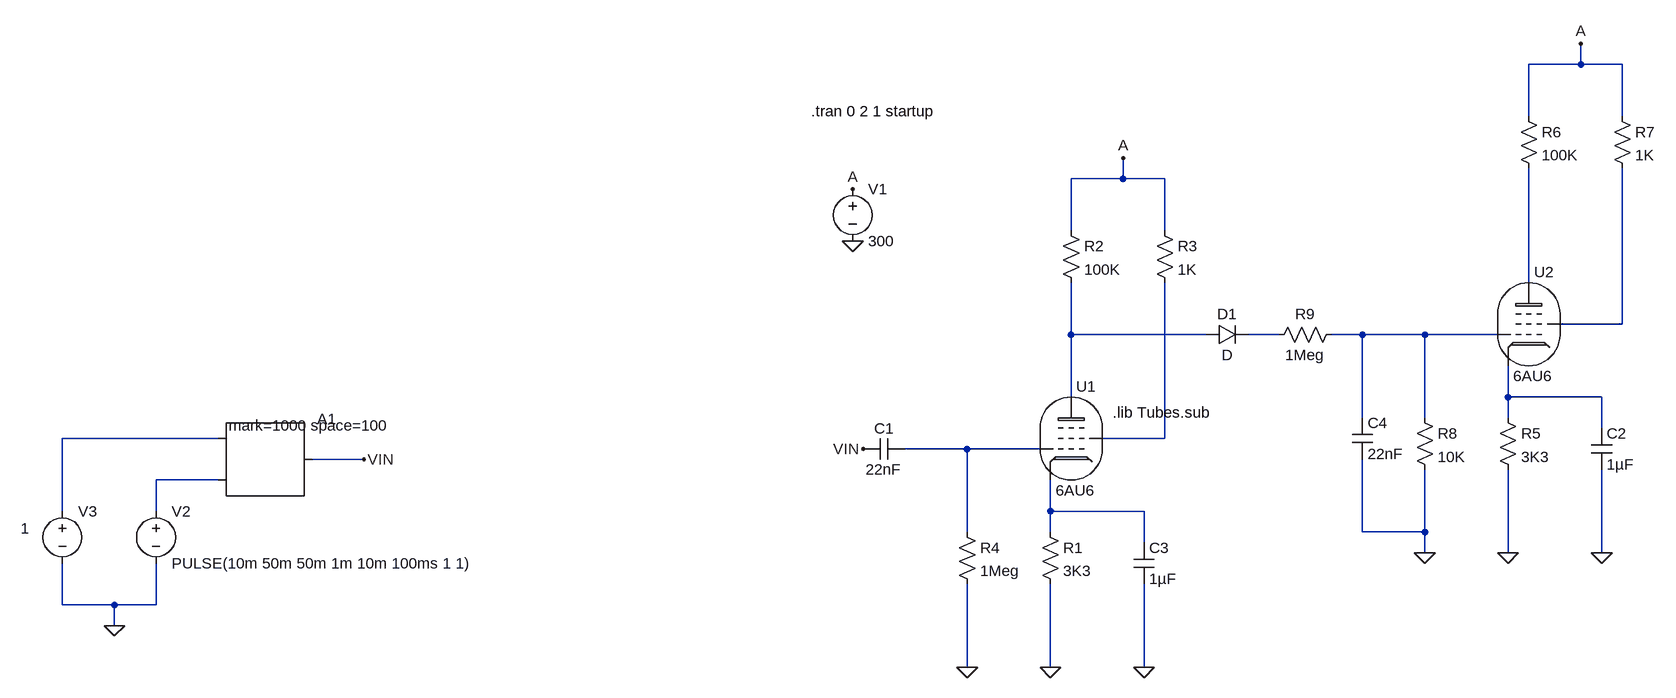
[diagram p0: schematic CompressorWith6AU6Penthode.asc]
CompressorWith6AU6Penthode.asc, the LTspice schematic file:
Version 4
SHEET 1 2100 680
WIRE 1232 -400 1232 -432
WIRE 1232 -400 1152 -400
WIRE 1296 -400 1232 -400
WIRE 1152 -320 1152 -400
WIRE 1296 -320 1296 -400
WIRE 528 -224 528 -256
WIRE 528 -224 448 -224
WIRE 592 -224 528 -224
WIRE 448 -144 448 -224
WIRE 592 -144 592 -224
WIRE 1152 -64 1152 -240
WIRE 1296 0 1296 -240
WIRE 1296 0 1200 0
WIRE 448 16 448 -64
WIRE 656 16 448 16
WIRE 768 16 720 16
WIRE 896 16 848 16
WIRE 992 16 896 16
WIRE 1104 16 992 16
WIRE 448 112 448 16
WIRE 1120 112 1120 64
WIRE 1264 112 1120 112
WIRE 896 144 896 16
WIRE 992 144 992 16
WIRE 1120 144 1120 112
WIRE 1264 160 1264 112
WIRE -864 176 -1104 176
WIRE 592 176 592 -64
WIRE 592 176 496 176
WIRE 288 192 192 192
WIRE 400 192 288 192
WIRE -640 208 -720 208
WIRE -864 240 -960 240
WIRE -1104 288 -1104 176
WIRE -960 288 -960 240
WIRE 416 288 416 240
WIRE 560 288 416 288
WIRE 288 320 288 192
WIRE 416 320 416 288
WIRE 896 320 896 208
WIRE 992 320 992 224
WIRE 992 320 896 320
WIRE 560 336 560 288
WIRE 992 352 992 320
WIRE 1120 352 1120 224
WIRE 1264 352 1264 224
WIRE -1104 432 -1104 368
WIRE -1024 432 -1104 432
WIRE -960 432 -960 368
WIRE -960 432 -1024 432
WIRE -1024 464 -1024 432
WIRE 288 528 288 400
WIRE 416 528 416 400
WIRE 560 528 560 400
FLAG 416 528 0
FLAG 528 -256 A
FLAG 288 528 0
FLAG 128 192 VIN
FLAG 112 -128 0
FLAG 112 -208 A
FLAG -1024 464 0
FLAG -640 208 VIN
FLAG 560 528 0
FLAG 1120 352 0
FLAG 1232 -432 A
FLAG 992 352 0
FLAG 1264 352 0
SYMBOL Misc\\pentode 448 176 R0
SYMATTR InstName U1
SYMATTR Value 6AU6
SYMBOL res 400 304 R0
SYMATTR InstName R1
SYMATTR Value 3K3
SYMBOL res 432 -160 R0
SYMATTR InstName R2
SYMATTR Value 100K
SYMBOL res 576 -160 R0
SYMATTR InstName R3
SYMATTR Value 1K
SYMBOL res 272 304 R0
SYMATTR InstName R4
SYMATTR Value 1Meg
SYMBOL voltage 112 -224 R0
WINDOW 123 0 0 Left 0
WINDOW 39 0 0 Left 0
SYMATTR InstName V1
SYMATTR Value 300
SYMBOL voltage -960 272 R0
WINDOW 123 0 0 Left 0
WINDOW 39 0 0 Left 0
SYMATTR InstName V2
SYMATTR Value PULSE(10m 50m 50m 1m 10m 100ms 1 1)
SYMBOL voltage -1104 272 R0
WINDOW 3 -64 42 Left 2
WINDOW 123 0 0 Left 0
WINDOW 39 0 0 Left 0
SYMATTR InstName V3
SYMATTR Value 1
SYMBOL SpecialFunctions\\modulate -864 176 R0
WINDOW 3 16 -20 Left 2
SYMATTR InstName A1
SYMATTR Value mark=1000 space=100
SYMBOL cap 544 336 R0
SYMATTR InstName C3
SYMATTR Value 1µF
SYMBOL cap 192 176 R90
WINDOW 0 0 32 VBottom 2
WINDOW 3 32 32 VTop 2
SYMATTR InstName C1
SYMATTR Value 22nF
SYMBOL Misc\\pentode 1152 0 R0
SYMATTR InstName U2
SYMATTR Value 6AU6
SYMBOL res 1104 128 R0
SYMATTR InstName R5
SYMATTR Value 3K3
SYMBOL res 1136 -336 R0
SYMATTR InstName R6
SYMATTR Value 100K
SYMBOL res 1280 -336 R0
SYMATTR InstName R7
SYMATTR Value 1K
SYMBOL res 976 128 R0
SYMATTR InstName R8
SYMATTR Value 10K
SYMBOL cap 1248 160 R0
SYMATTR InstName C2
SYMATTR Value 1µF
SYMBOL diode 656 32 R270
WINDOW 0 32 32 VTop 2
WINDOW 3 0 32 VBottom 2
SYMATTR InstName D1
SYMBOL cap 880 144 R0
SYMATTR InstName C4
SYMATTR Value 22nF
SYMBOL res 864 0 R90
WINDOW 0 0 56 VBottom 2
WINDOW 3 32 56 VTop 2
SYMATTR InstName R9
SYMATTR Value 1Meg
TEXT 512 136 Left 2 !.lib Tubes.sub
TEXT 48 -328 Left 2 !.tran 0 2 1 startup

The netlist it stands for:
* CompressorWith6AU6Penthode.asc
XU1 N003 N008 N009 N011 6AU6  ; pins Anode G2 G1 Cathode
R1 N011 0 3K3
R2 A N003 100K
R3 A N008 1K
R4 N009 0 1Meg
V1 A 0 300
V2 N010 0 PULSE(10m 50m 50m 1m 10m 100ms 1 1)
V3 N007 0 1
A1 N007 N010 0 0 0 0 VIN 0 MODULATOR mark=1000 space=100
C3 N011 0 1µF
C1 N009 VIN 22nF
XU2 N001 N002 N005 N006 6AU6  ; pins Anode G2 G1 Cathode
R5 N006 0 3K3
R6 A N001 100K
R7 A N002 1K
R8 N005 0 10K
C2 N006 0 1µF
D1 N003 N004 D
C4 N005 0 22nF
R9 N005 N004 1Meg
.model D D
.lib standard.dio
.lib Tubes.sub
.tran 0 2 1 startup
.backanno
.end